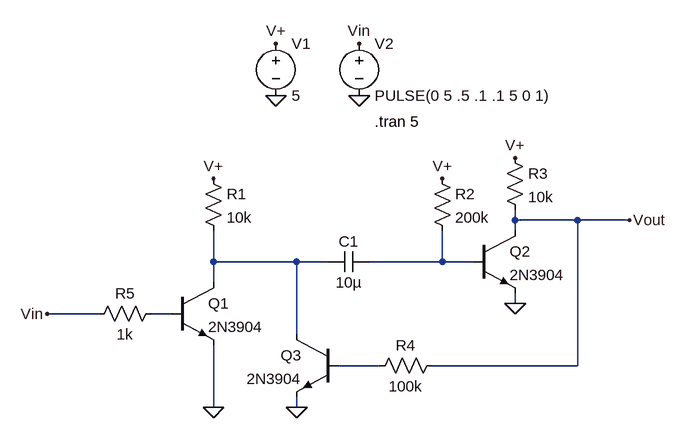
[diagram p0: schematic 10A-10.asc]
10A-10.asc, the LTspice schematic file:
Version 4.1
SHEET 1 880 680
WIRE 608 32 608 16
WIRE 704 32 608 32
WIRE 784 32 704 32
WIRE 608 48 608 32
WIRE 144 96 144 48
WIRE 272 96 144 96
WIRE 320 96 272 96
WIRE 496 96 496 48
WIRE 496 96 384 96
WIRE 544 96 496 96
WIRE 144 128 144 96
WIRE 608 160 608 144
WIRE -32 176 -112 176
WIRE 80 176 48 176
WIRE 272 208 272 96
WIRE 400 256 336 256
WIRE 704 256 704 32
WIRE 704 256 480 256
WIRE 144 320 144 224
WIRE 272 320 272 304
FLAG 144 320 0
FLAG 272 320 0
FLAG 608 160 0
FLAG 608 -64 V+
FLAG 496 -32 V+
FLAG 144 -32 V+
FLAG 240 -160 0
FLAG 240 -240 V+
FLAG 368 -160 0
FLAG 368 -240 Vin
FLAG -112 176 Vin
FLAG 784 32 Vout
SYMBOL npn 80 128 R0
SYMATTR InstName Q1
SYMATTR Value 2N3904
SYMBOL npn 544 48 R0
SYMATTR InstName Q2
SYMATTR Value 2N3904
SYMBOL npn 336 208 M0
SYMATTR InstName Q3
SYMATTR Value 2N3904
SYMBOL res 128 -48 R0
SYMATTR InstName R1
SYMATTR Value 10k
SYMBOL cap 384 80 R90
WINDOW 0 0 32 VBottom 2
WINDOW 3 32 32 VTop 2
SYMATTR InstName C1
SYMATTR Value 10µ
SYMBOL res 480 -48 R0
SYMATTR InstName R2
SYMATTR Value 200k
SYMBOL res 592 -80 R0
SYMATTR InstName R3
SYMATTR Value 10k
SYMBOL res 496 240 R90
WINDOW 0 0 56 VBottom 2
WINDOW 3 32 56 VTop 2
SYMATTR InstName R4
SYMATTR Value 100k
SYMBOL res 64 160 R90
WINDOW 0 0 56 VBottom 2
WINDOW 3 32 56 VTop 2
SYMATTR InstName R5
SYMATTR Value 1k
SYMBOL voltage 240 -256 R0
WINDOW 123 0 0 Left 0
WINDOW 39 0 0 Left 0
SYMATTR InstName V1
SYMATTR Value 5
SYMBOL voltage 368 -256 R0
WINDOW 123 0 0 Left 0
WINDOW 39 0 0 Left 0
SYMATTR InstName V2
SYMATTR Value PULSE(0 5 .5 .1 .1 5 0 1)
TEXT 392 -120 Left 2 !.tran 5

The netlist it stands for:
* 10A-10.asc
Q1 N001 N003 0 0 2N3904
Q2 Vout N002 0 0 2N3904
Q3 N001 N004 0 0 2N3904
R1 V+ N001 10k
C1 N002 N001 10µ
R2 V+ N002 200k
R3 V+ Vout 10k
R4 Vout N004 100k
R5 N003 Vin 1k
V1 V+ 0 5
V2 Vin 0 PULSE(0 5 .5 .1 .1 5 0 1)
.model NPN NPN
.model PNP PNP
.lib standard.bjt
.tran 5
.backanno
.end